# EasyEDA Pro project RFID_Auth_ESP32_Schematic_Achyuth_chargeMOD.epro

# Schematic RFID_Auth_ESP32
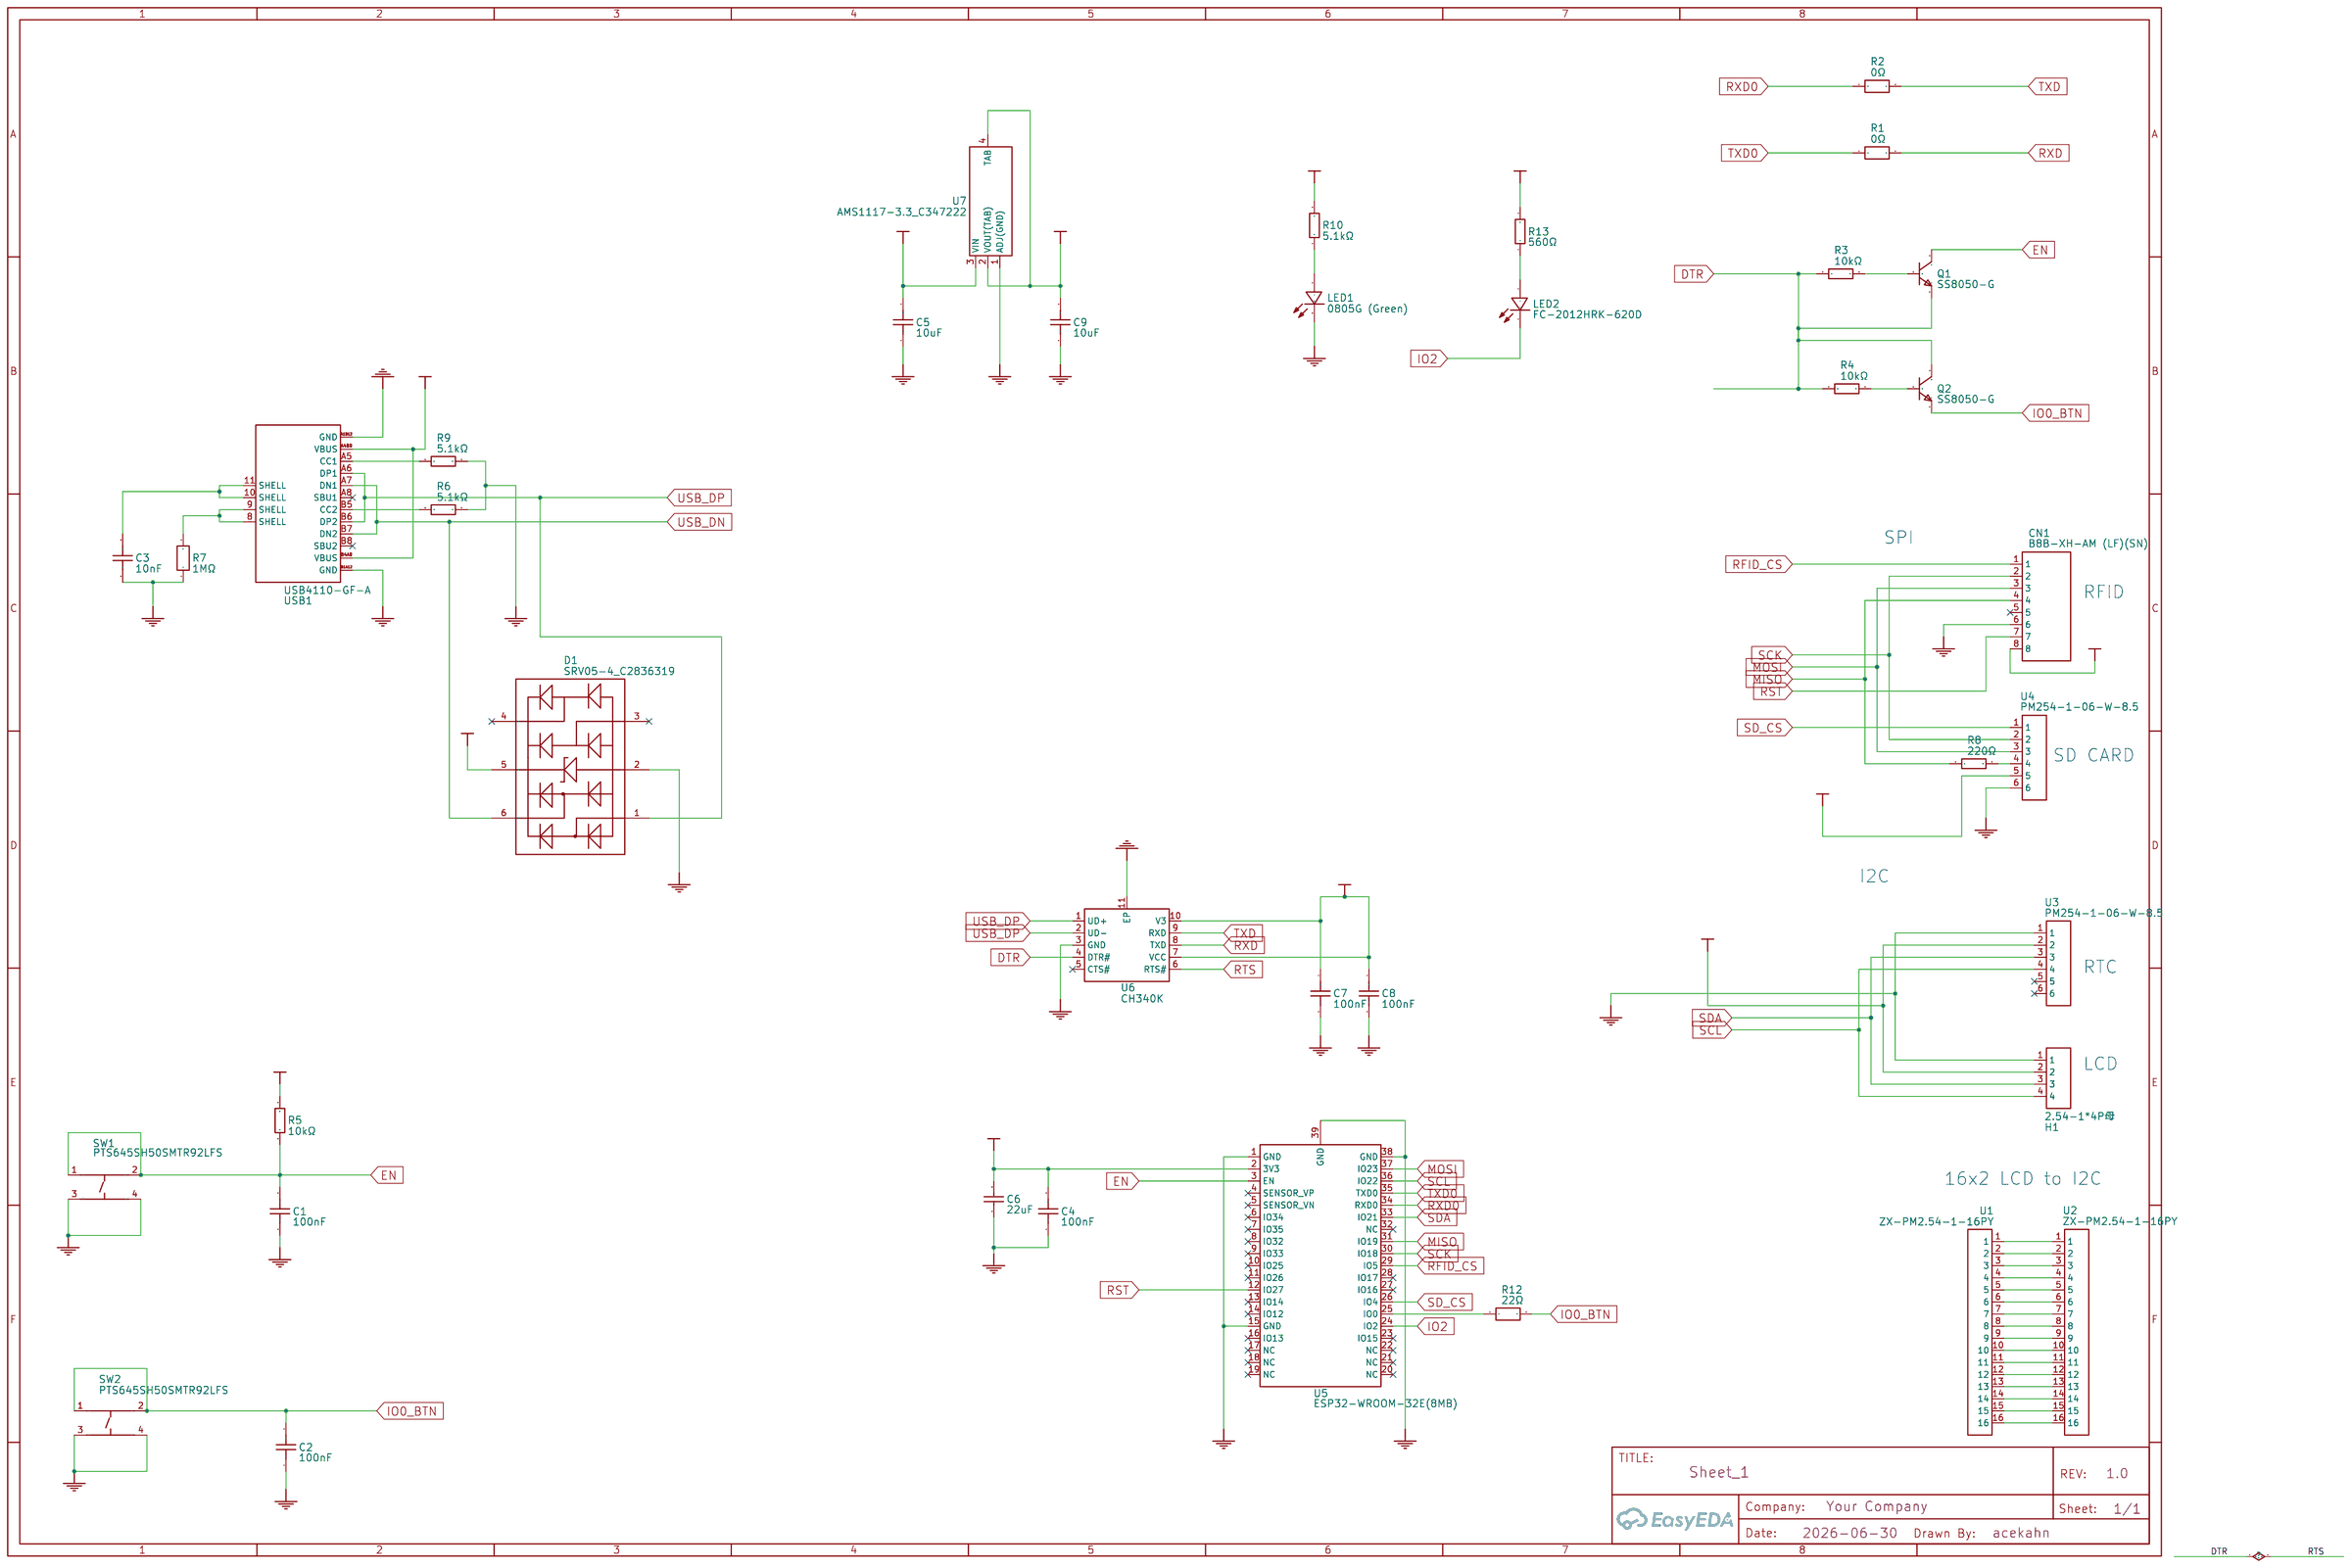
[diagram p0: schematic sheet]

## Parts
C1  100nF  [C0805]
C2  100nF  [C0805]
C3  10nF  [C0805]
C4  100nF  [C0805]
C5  10uF  [C0805]
C6  22uF  [C0805]
C7  100nF  [C0805]
C8  100nF  [C0805]
C9  10uF  [C0805]
CN1  B8B-XH-AM (LF)(SN)  [CONN-TH_B8B-XH-AM-LF-SN]
D1  SRV05-4_C2836319  [SOT-23-6_L2.9-W1.6-P0.95-LS2.8-BL]
H1  2.54-1*4P母  [HDR-TH_4P-P2.54-V-F]
LED1  0805G (Green)  [LED0805-R-RD]
LED2  FC-2012HRK-620D  [LED0805-RD]
Q1  SS8050-G  [SOT-23-3_L2.9-W1.3-P1.90-LS2.4-BR]
Q2  SS8050-G  [SOT-23-3_L2.9-W1.3-P1.90-LS2.4-BR]
R1  0Ω  [R0603]
R2  0Ω  [R0603]
R3  10kΩ  [R0805]
R4  10kΩ  [R0805]
R5  10kΩ  [R0805]
R6  5.1kΩ  [R0805]
R7  1MΩ  [R0805]
R8  220Ω  [R0805]
R9  5.1kΩ  [R0805]
R10  5.1kΩ  [R0805]
R12  22Ω  [R0805]
R13  560Ω  [R0805]
SW1  PTS645SH50SMTR92LFS  [KEY-SMD_4P-L6.0-W6.0-P4.50-LS9.0]
SW2  PTS645SH50SMTR92LFS  [KEY-SMD_4P-L6.0-W6.0-P4.50-LS9.0]
U1  ZX-PM2.54-1-16PY  [HDR-TH_16P-P2.54-V-F-1]
U2  ZX-PM2.54-1-16PY  [HDR-TH_16P-P2.54-V-F-1]
U3  PM254-1-06-W-8.5  [HDR-TH_6P-P2.54-H-F-W10.0-N]
U4  PM254-1-06-W-8.5  [HDR-TH_6P-P2.54-H-F-W10.0-N]
U5  ESP32-WROOM-32E(8MB)  [WIFI-SMD_ESP32-WROOM-32E]
U6  CH340K  [ESOP-10_L4.9-W3.9-P1.00-LS6.2-BL-EP]
U7  AMS1117-3.3_C347222  [SOT-223-4_L6.5-W3.5-P2.30-LS7.0-BR]
USB1  USB4110-GF-A  [USB-C-SMD_TYPE-C-16P-USB4110-GF-A]

## Library data of the parts
C1 C2 C4 = C0805C104K4RACTU: Supplier: LCSC; Supplier Part: C19186128; Manufacturer: KEMET(基美); JLCPCB Part Class: Extended Part
C3 = CC0805KRX7R9BB103: Supplier: LCSC; Manufacturer: YAGEO(国巨); Supplier Part: C83170; JLCPCB Part Class: Extended Part
C5 C9 = GRM21BZ71C106KE15L: Supplier: LCSC; Supplier Part: C162430; Manufacturer: muRata(村田); JLCPCB Part Class: Extended Part
C6 = CL21A226MOQNNNE: Supplier: LCSC; Manufacturer: SAMSUNG(三星); Supplier Part: C98190; JLCPCB Part Class: Extended Part
C7 C8 = C0805C104J4RACTU: Supplier: LCSC; Supplier Part: C2171428; Manufacturer: KEMET(基美); JLCPCB Part Class: Extended Part
CN1 = B8B-XH-AM(LF)(SN): Supplier: LCSC; Supplier Part: C161875; Manufacturer: JST; JLCPCB Part Class: Extended Part
D1 = SRV05-4: Supplier: LCSC; Supplier Part: C2836319; Manufacturer: MSKSEMI(美森科); JLCPCB Part Class: Extended Part
H1 = 2.54-1*4P母: Supplier: LCSC; Supplier Part: C2718488; Manufacturer: BOOMELE(博穆精密); JLCPCB Part Class: Extended Part
LED1 = KT-0805G: Supplier: LCSC; Manufacturer: KENTO; Supplier Part: C2297; JLCPCB Part Class: Basic Part
LED2 = NCD0805R1: Supplier: LCSC; Manufacturer: 国星光电; Supplier Part: C84256; JLCPCB Part Class: Basic Part
Q1 Q2 = SS8050-G(RANGE:120-200): Supplier: LCSC; Manufacturer: CJ(江苏长电/长晶); Supplier Part: C164886; JLCPCB Part Class: Extended Part
R1 R2 = HQ03W5F0000T5E: Supplier: LCSC; Supplier Part: C2791791; Manufacturer: UNI-ROYAL(厚声); JLCPCB Part Class: Extended Part
R3-R5 = TC0525F1002T5G: Supplier: LCSC; Supplier Part: C2988949; Manufacturer: UNI-ROYAL(厚声); JLCPCB Part Class: Extended Part
R6 R9 R10 = 0805W8F5101T5E: Supplier: LCSC; Manufacturer: UNI-ROYAL(厚声); Supplier Part: C27834; JLCPCB Part Class: Basic Part
R7 = FRC0805F1004TS: Supplier: LCSC; Supplier Part: C2933280; Manufacturer: FOJAN(富捷); JLCPCB Part Class: Extended Part
R8 = 0805W8F2200T5E: Supplier: LCSC; Manufacturer: UNI-ROYAL(厚声); Supplier Part: C17557; JLCPCB Part Class: Basic Part
R12 = FRC0805F22R0TS: Supplier: LCSC; Supplier Part: C2907244; Manufacturer: FOJAN(富捷); JLCPCB Part Class: Extended Part
R13 = 0805W8F5600T5E: Supplier: LCSC; Manufacturer: UNI-ROYAL(厚声); Supplier Part: C28636; JLCPCB Part Class: Basic Part
SW1 SW2 = PTS645SH50SMTR92LFS: Supplier: LCSC; Supplier Part: C221869; Manufacturer: C&K; JLCPCB Part Class: Extended Part
U1 U2 = ZX-PM2.54-1-16PY: Supplier: LCSC; Supplier Part: C7499334; Manufacturer: Megastar(兆星); JLCPCB Part Class: Extended Part
U3 U4 = PM254-1-06-W-8.5: Supplier: LCSC; Supplier Part: C2897388; Manufacturer: HCTL(华灿天禄); JLCPCB Part Class: Extended Part
U5 = ESP32-WROOM-32E-N8: Supplier: LCSC; Supplier Part: C701342; Manufacturer: ESPRESSIF(乐鑫); JLCPCB Part Class: Extended Part
U6 = CH340K: Supplier: LCSC; Supplier Part: C968586; Manufacturer: WCH(南京沁恒); JLCPCB Part Class: Extended Part
U7 = AMS1117-3.3: Supplier: LCSC; Supplier Part: C347222; Manufacturer: UMW(友台半导体); JLCPCB Part Class: Extended Part
USB1 = USB4110-GF-A: Supplier: LCSC; Supplier Part: C5143397; Manufacturer: GCT; JLCPCB Part Class: Extended Part

## Nets
+3V3: C4.2 C6.2 C7.1 C8.1 C9.2 CN1.8 R5.2 R10.2 R13.2 U5.2(3V3) U6.7(VCC) U6.10(V3) U7.2(VOUT(TAB)) U7.4(TAB)
+5V: C5.2 D1.5 H1.2 U3.2 U4.5 U7.3(VIN) USB1.A4B9(VBUS) USB1.B4A9(VBUS)
GND: C1.1 C2.1 C3.1 C4.1 C5.1 C6.1 C7.2 C8.2 C9.1 CN1.6 D1.2 H1.1 LED1.2(K) R6.1 R7.1 R9.1 SW1.3 SW1.4 SW2.3 SW2.4 U3.1 U4.6 U5.1(GND) U5.15(GND) U5.38(GND) U5.39(GND) U6.3(GND) U6.11(EP) U7.1(ADJ(GND)) USB1.A1B12(GND) USB1.B1A12(GND)
DTR: Q1.2(E) Q2.3(C) R3.1 R4.1 U6.4(DTR#) U6.6(RTS#)
EN: C1.2 Q1.3(C) R5.1 SW1.1 SW1.2 U5.3(EN)
IO0_BTN: C2.2 Q2.2(E) R12.2 SW2.1 SW2.2
IO2: LED2.1(-) U5.24(IO2)
MISO: CN1.4 R8.1 U5.31(IO19)
MOSI: CN1.3 U4.3 U5.37(IO23)
RFID_CS: CN1.1 U5.29(IO5)
RST: CN1.7 U5.12(IO27)
RXD: R1.2 U6.8(TXD)
RXD0: R2.1 U5.34(RXD0)
SCK: CN1.2 U4.2 U5.30(IO18)
SCL: H1.4 U3.4 U5.36(IO22)
SD_CS: U4.1 U5.26(IO4)
SDA: H1.3 U3.3 U5.33(IO21)
TXD: R2.2 U6.9(RXD)
TXD0: R1.1 U5.35(TXD0)
USB_DN: D1.6 USB1.A7(DN1) USB1.B7(DN2)
USB_DP: D1.1 U6.1(UD+) U6.2(UD-) USB1.A6(DP1) USB1.B6(DP2)
Net-(C3-2): C3.2 USB1.10(SHELL) USB1.11(SHELL)
Net-(LED1-1): LED1.1(A) R10.1
Net-(LED2-2): LED2.2(+) R13.1
Net-(Q1-1): Q1.1(B) R3.2
Net-(Q2-1): Q2.1(B) R4.2
Net-(R6-2): R6.2 USB1.B5(CC2)
Net-(R7-2): R7.2 USB1.8(SHELL) USB1.9(SHELL)
Net-(R8-2): R8.2 U4.4
Net-(R9-2): R9.2 USB1.A5(CC1)
Net-(R12-1): R12.1 U5.25(IO0)
Net-(U1-1): U1.1 U2.1
Net-(U1-2): U1.2 U2.2
Net-(U1-3): U1.3 U2.3
Net-(U1-4): U1.4 U2.4
Net-(U1-5): U1.5 U2.5
Net-(U1-6): U1.6 U2.6
Net-(U1-7): U1.7 U2.7
Net-(U1-8): U1.8 U2.8
Net-(U1-9): U1.9 U2.9
Net-(U1-10): U1.10 U2.10
Net-(U1-11): U1.11 U2.11
Net-(U1-12): U1.12 U2.12
Net-(U1-13): U1.13 U2.13
Net-(U1-14): U1.14 U2.14
Net-(U1-15): U1.15 U2.15
Net-(U1-16): U1.16 U2.16

Not connected (* = marked no-connect by the designer): CN1 5*; D1 3* 4*; U3 5* 6*; U5 4(SENSOR_VP)* 5(SENSOR_VN)* 6(IO34)* 7(IO35)* 8(IO32)* 9(IO33)* 10(IO25)* 11(IO26)* 13(IO14)* 14(IO12)* 16(IO13)* 17(NC)* 18(NC)* 19(NC)* 20(NC)* 21(NC)* 22(NC)* 23(IO15)* 27(IO16)* 28(IO17)* 32(NC)*; U6 5(CTS#)*; USB1 A8(SBU1)* B8(SBU2)*

## Notes on the sheet
- SPI
- RFID
- SD CARD
- I2C
- RTC
- LCD
- 16x2 LCD to I2C
